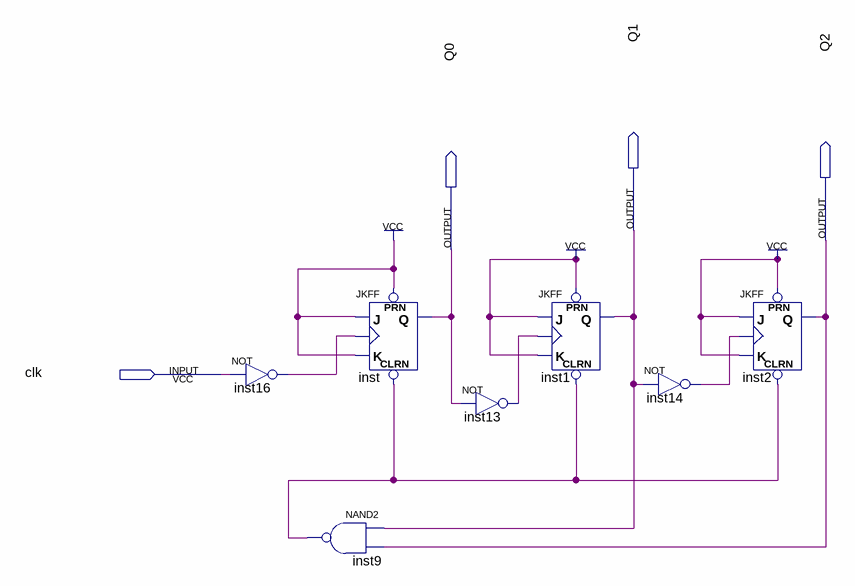
[diagram p0: schematic sheet]
// Quartus schematic MOD6.bdf as structural Verilog: 7 symbols, 4 pins
module MOD6 (
  input  clk,
  output Q1,
  output Q2,
  output Q0
);

  wire inst9_out, inst13_out, inst14_out, inst16_out;

  not inst16 (inst16_out, clk);
  nand inst9 (inst9_out, Q1, Q2);
  JKFF inst (.PRN(1'b1), .CLRN(inst9_out), .K(1'b1), .J(1'b1), .CLK(inst16_out), .Q(Q0));
  not inst13 (inst13_out, Q0);
  JKFF inst1 (.PRN(1'b1), .CLRN(inst9_out), .K(1'b1), .J(1'b1), .CLK(inst13_out), .Q(Q1));
  not inst14 (inst14_out, Q1);
  JKFF inst2 (.PRN(1'b1), .CLRN(inst9_out), .K(1'b1), .J(1'b1), .CLK(inst14_out), .Q(Q2));
endmodule
